# Altium schematic sheet [08] - CPU TF_CARD,USB OTG.SchDoc
size A2; DocumentNumber: 8; SheetNumber: 8; SheetTotal: 20
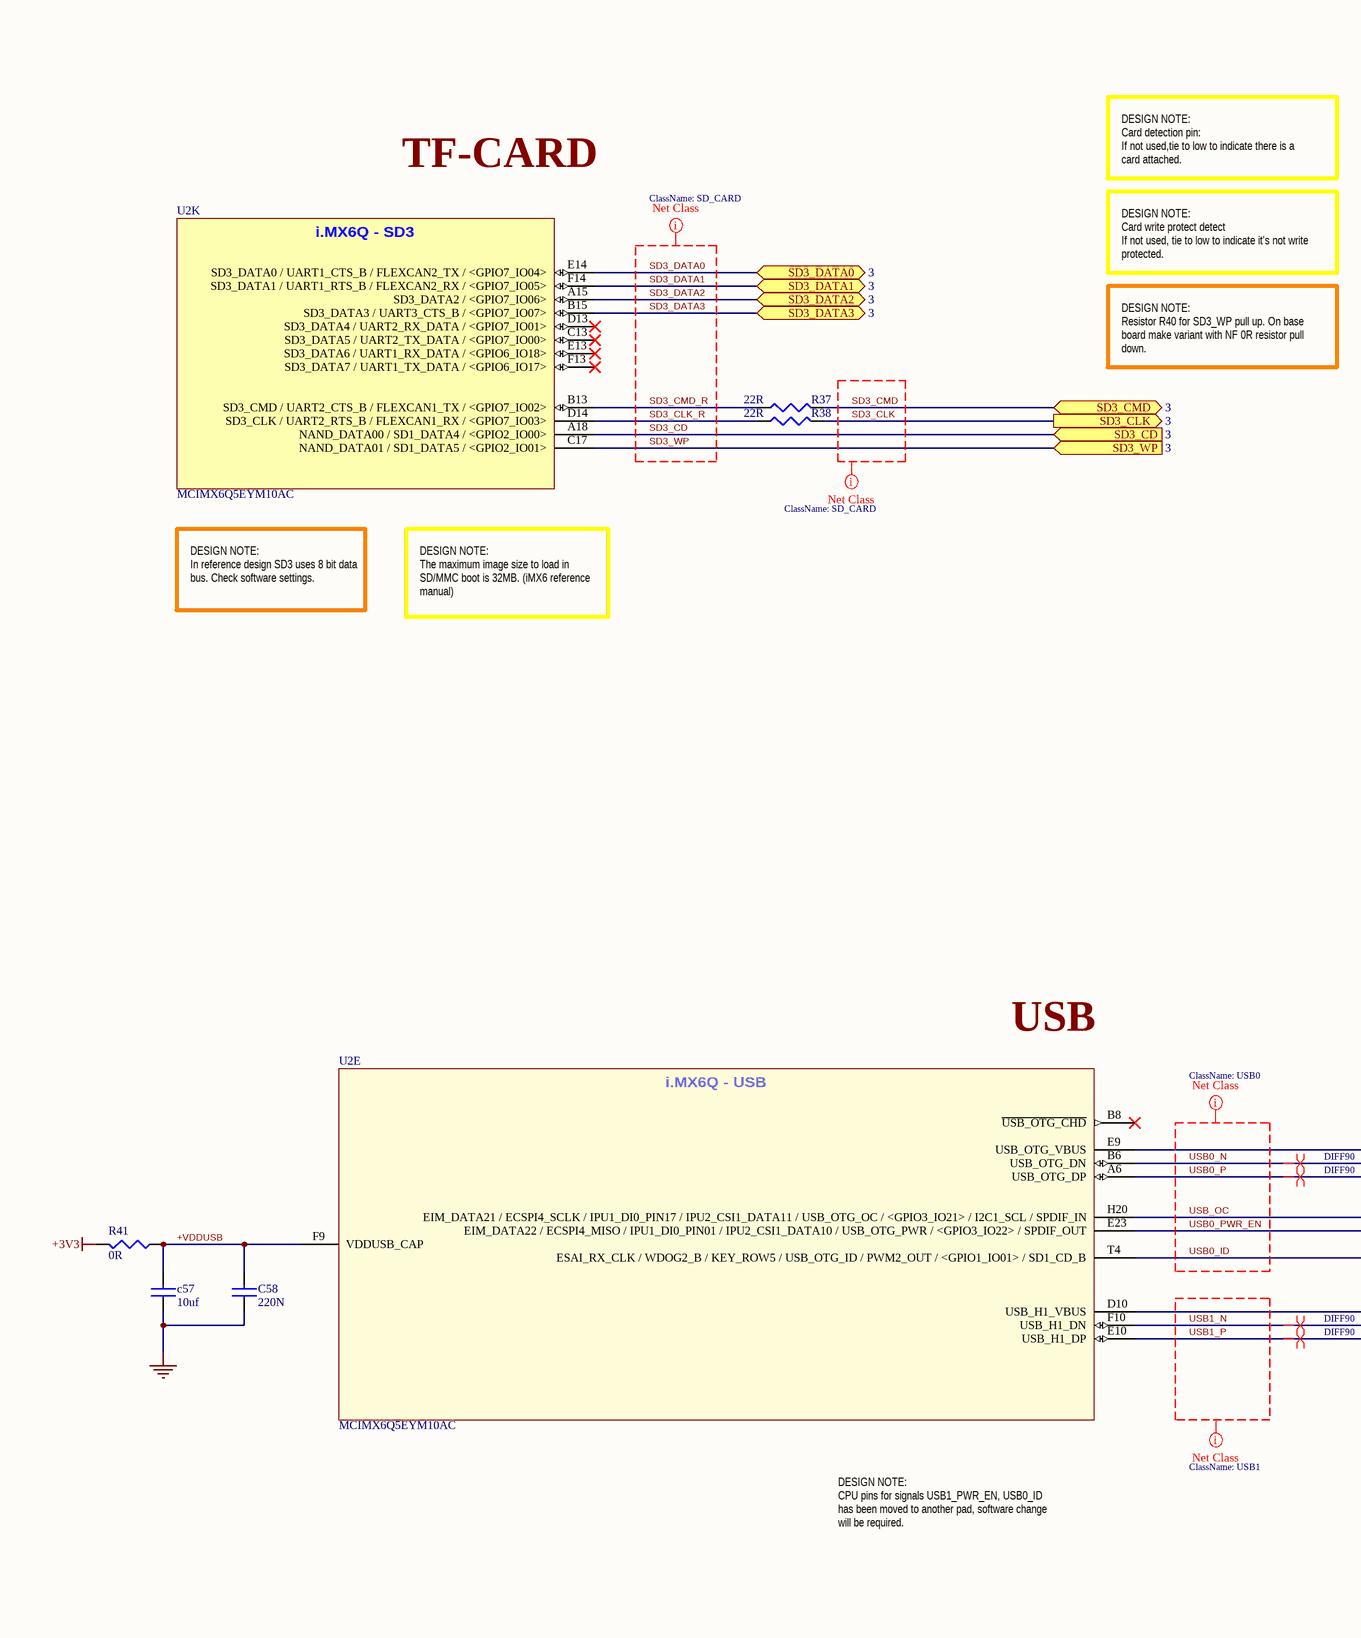
[diagram p0: [08] - CPU TF_CARD,USB OTG.SchDoc, left]
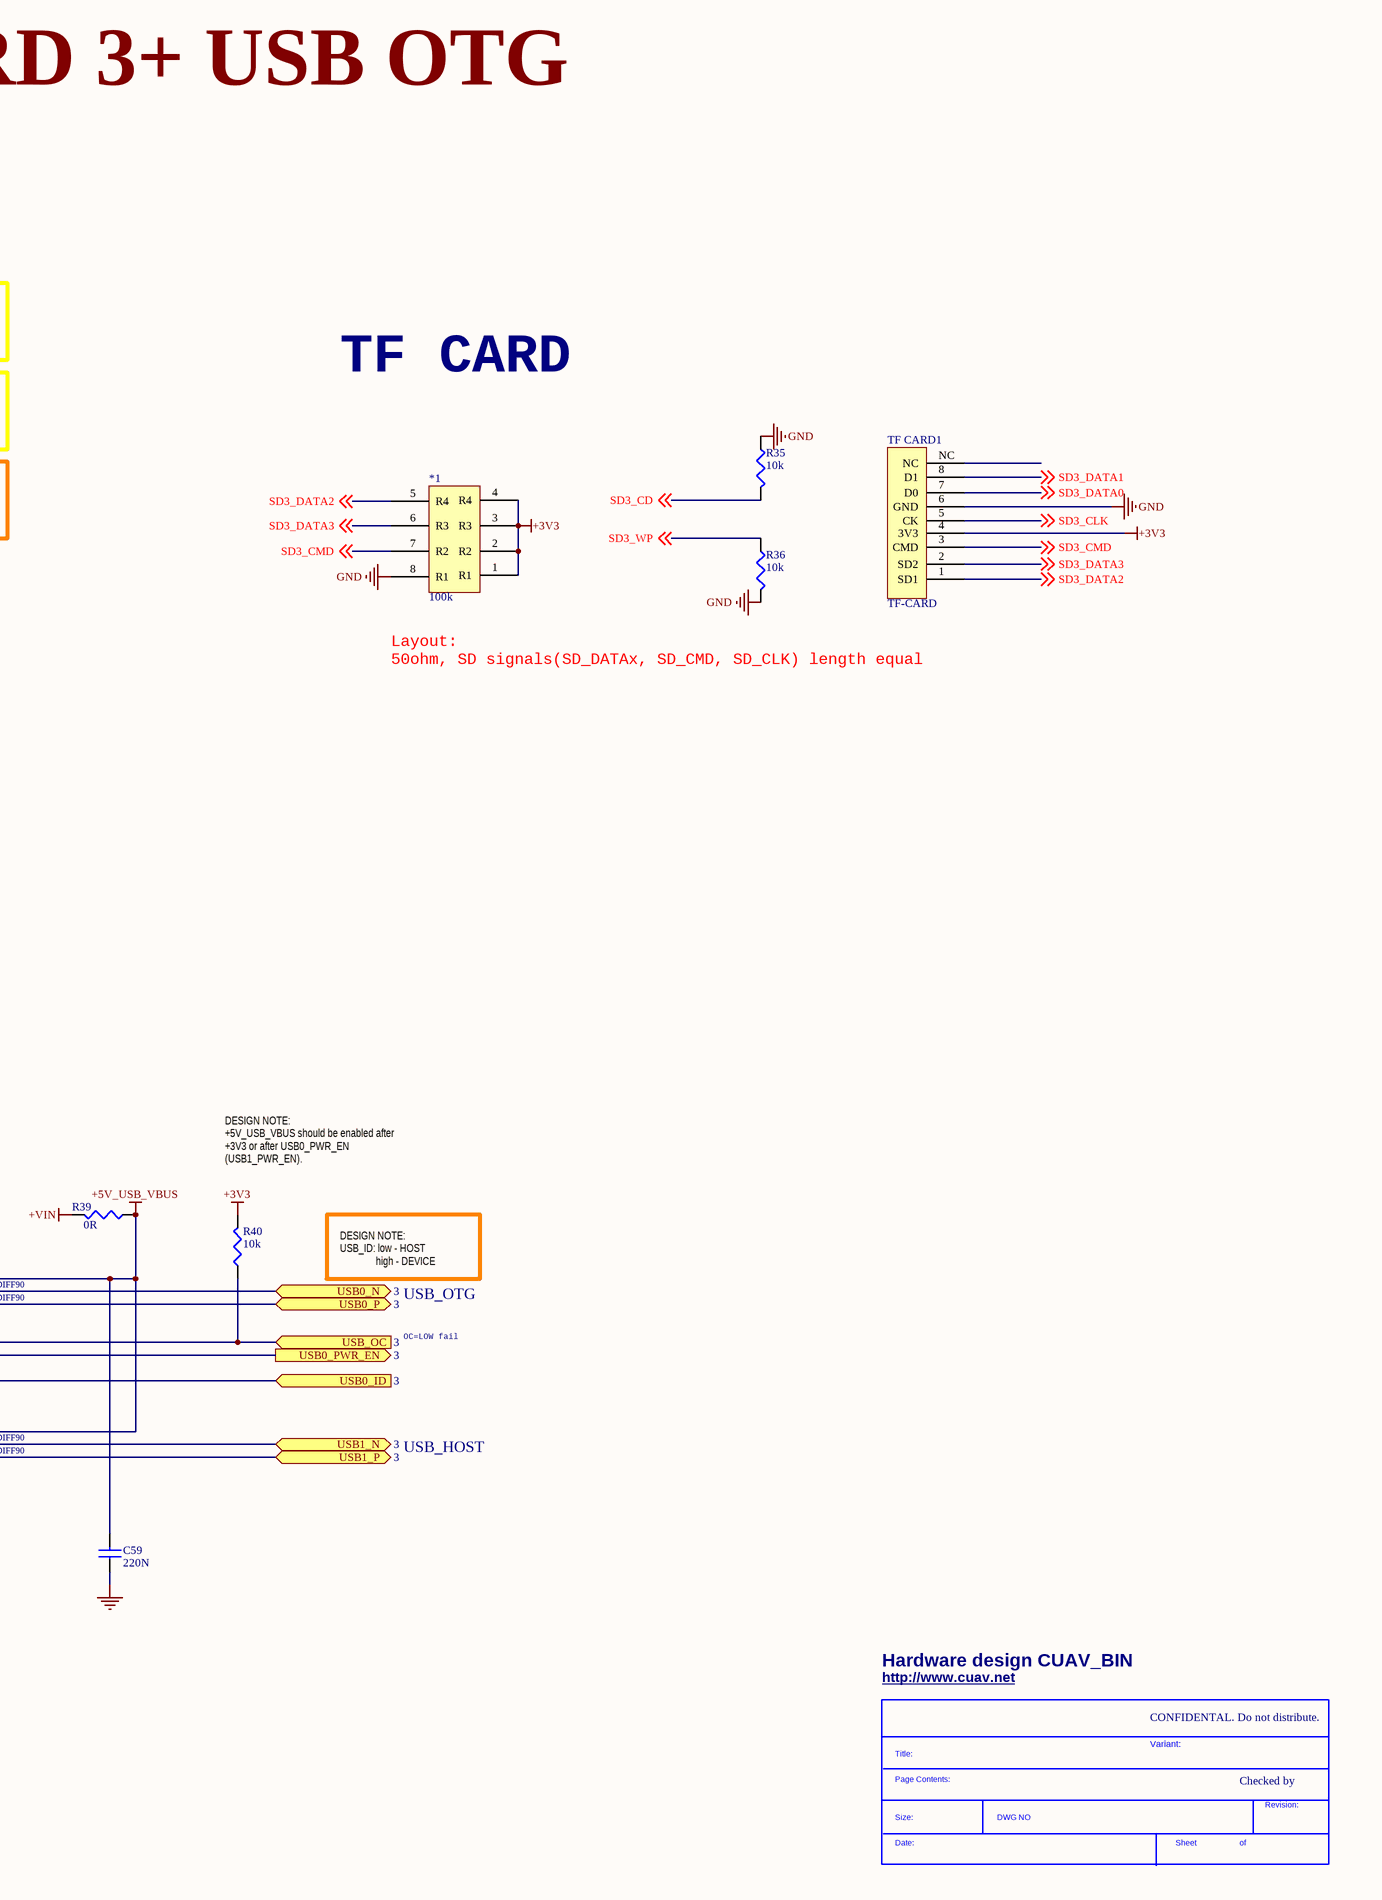
[diagram p1: [08] - CPU TF_CARD,USB OTG.SchDoc, right]

## Parts
*  SDTitleBlock  (value not drawn)  (graphical)
*1  100k  [0402_4R]
c57  10uf  [0402cap]
C58  220N  [0402cap]
C59  220N  [0402cap]
R35  10k  [R0402]
R36  10k  [R0402]
R37  22R  [R0402]
R38  22R  [R0402]
R39  0R  [R0402]
R40  10k  [R0402]
R41  0R  [R0402]
TF_CARD1  TF-CARD  [47352-1001]
U2  MCIMX6Q5EYM10AC  [PBGA624]  (parts E,K of 15)

## Ports
SD3_CD (in, see 3), SD3_CLK (out, see 3), SD3_CMD (bidir, see 3), SD3_DATA0 (bidir, see 3), SD3_DATA1 (bidir, see 3), SD3_DATA2 (bidir, see 3), SD3_DATA3 (bidir, see 3), SD3_WP (in, see 3), USB0_ID (in, see 3), USB0_N (bidir, see 3), USB0_P (bidir, see 3), USB0_PWR_EN (out, see 3), USB1_N (bidir, see 3), USB1_P (bidir, see 3), USB_OC (in, see 3)

## Nets
+3V3: *1.1(R1) *1.2(R2) *1.3(R3) *1.4(R4) R40.2 R41.2 TF_CARD1.4(3V3)
+5V_USB_VBUS: C59.2 R39.1 U2.D10(USB_H1_VBUS) U2.E9(USB_OTG_VBUS)
+VIN: R39.2
GND: *1.8(R1) c57.1 C58.1 C59.1 R35.1 R36.2 TF_CARD1.6(GND)
+VDDUSB: c57.2 C58.2 R41.1 U2.F9(VDDUSB_CAP)
SD3_CD: R35.2 U2.A18(NAND_DATA00_/_SD1_DATA4_/_<GPIO2_IO00>) ; off-sheet SD3_CD, port SD3_CD
SD3_CLK: R38.2 TF_CARD1.5(CK) ; off-sheet SD3_CLK, port SD3_CLK
SD3_CLK_R: R38.1 U2.D14(SD3_CLK_/_UART2_RTS_B_/_FLEXCAN1_RX_/_<GPIO7_IO03>)
SD3_CMD: *1.7(R2) R37.2 TF_CARD1.3(CMD) ; off-sheet SD3_CMD, port SD3_CMD
SD3_CMD_R: R37.1 U2.B13(SD3_CMD_/_UART2_CTS_B_/_FLEXCAN1_TX_/_<GPIO7_IO02>)
SD3_DATA0: TF_CARD1.7(D0) U2.E14(SD3_DATA0_/_UART1_CTS_B_/_FLEXCAN2_TX_/_<GPIO7_IO04>) ; off-sheet SD3_DATA0, port SD3_DATA0
SD3_DATA1: TF_CARD1.8(D1) U2.F14(SD3_DATA1_/_UART1_RTS_B_/_FLEXCAN2_RX_/_<GPIO7_IO05>) ; off-sheet SD3_DATA1, port SD3_DATA1
SD3_DATA2: *1.5(R4) TF_CARD1.1(SD1) U2.A15(SD3_DATA2_/_<GPIO7_IO06>) ; off-sheet SD3_DATA2, port SD3_DATA2
SD3_DATA3: *1.6(R3) TF_CARD1.2(SD2) U2.B15(SD3_DATA3_/_UART3_CTS_B_/_<GPIO7_IO07>) ; off-sheet SD3_DATA3, port SD3_DATA3
SD3_WP: R36.1 U2.C17(NAND_DATA01_/_SD1_DATA5_/_<GPIO2_IO01>) ; off-sheet SD3_WP, port SD3_WP
USB0_ID: U2.T4(ESAI_RX_CLK_/_WDOG2_B_/_KEY_ROW5_/_USB_OTG_ID_/_PWM2_OUT_/_<GPIO1_IO01>_/_SD1_CD_B) ; port USB0_ID
USB0_N: U2.B6(USB_OTG_DN) ; port USB0_N
USB0_P: U2.A6(USB_OTG_DP) ; port USB0_P
USB0_PWR_EN: U2.E23(EIM_DATA22_/_ECSPI4_MISO_/_IPU1_DI0_PIN01_/_IPU2_CSI1_DATA10_/_USB_OTG_PWR_/_<GPIO3_IO22>_/_SPDIF_OUT) ; port USB0_PWR_EN
USB1_N: U2.F10(USB_H1_DN) ; port USB1_N
USB1_P: U2.E10(USB_H1_DP) ; port USB1_P
USB_OC: R40.1 U2.H20(EIM_DATA21_/_ECSPI4_SCLK_/_IPU1_DI0_PIN17_/_IPU2_CSI1_DATA11_/_USB_OTG_OC_/_<GPIO3_IO21>_/_I2C1_SCL_/_SPDIF_IN) ; port USB_OC

Not connected (* = marked no-connect by the designer): TF_CARD1 NC; U2 B8(~{USB_OTG_CHD})* C13(SD3_DATA5_/_UART2_TX_DATA_/_<GPIO7_IO00>)* D13(SD3_DATA4_/_UART2_RX_DATA_/_<GPIO7_IO01>)* E13(SD3_DATA6_/_UART1_RX_DATA_/_<GPIO6_IO18>)* F13(SD3_DATA7_/_UART1_TX_DATA_/_<GPIO6_IO17>)*

## Layout directives
net class SD_CARD: SD3_CD, SD3_CLK, SD3_CLK_R, SD3_CMD, SD3_CMD_R, SD3_DATA0, SD3_DATA1, SD3_DATA2, SD3_DATA3, SD3_WP
differential pair; net class DIFF90: USB0_N, USB0_P, USB1_N, USB1_P
net class USB0: USB0_ID, USB0_N, USB0_P, USB0_PWR_EN, USB_OC
net class USB1: USB1_N, USB1_P

## Notes on the sheet
- CPU - TF CARD 3+ USB OTG
- TF-CARD
- DESIGN NOTE:
  Card detection pin:
  If not used,tie to low to indicate there is a card attached.
- TF CARD
- DESIGN NOTE:
  Card write protect detect
  If not used, tie to low to indicate it's not write protected.
- DESIGN NOTE:
  Resistor R40 for SD3_WP pull up. On base board make variant with NF 0R resistor pull down.
- Layout:
  50ohm, SD signals(SD_DATAx, SD_CMD, SD_CLK) length equal
- DESIGN NOTE:
  In reference design SD3 uses 8 bit data bus. Check software settings.
- DESIGN NOTE:
  The maximum image size to load in SD/MMC boot is 32MB. (iMX6 reference manual)
- USB
- DESIGN NOTE:
  +5V_USB_VBUS should be enabled after +3V3 or after USB0_PWR_EN (USB1_PWR_EN).
- DESIGN NOTE:
  USB_ID: low - HOST
  high - DEVICE
- USB_OTG
- OC=LOW fail
- USB_HOST
- DESIGN NOTE:
  CPU pins for signals USB1_PWR_EN, USB0_ID has been moved to another pad, software change will be required.
- (near *) Hardware design CUAV_BIN
- (near *) http://www.cuav.net
- CONFIDENTAL. Do not distribute.
- Variant:
- Checked by
- (in symbol MCIMX6Q5EYM10AC, part E) i.MX6Q - USB
- (in symbol MCIMX6Q5EYM10AC, part K) i.MX6Q - SD3
- (in symbol SDTitleBlock) Title:; Page Contents:; Revision:; Size:; DWG NO; Date:; Sheet; of

## Library data of the parts
*1 = 0402_4R
c57 C58 C59 = C1005X5R1H104K: CAP CER .10UF 50V X5R 10% 0402; Manufacturer: TDK Corporation; Capacitance: 0.1礔; Value: 100nF; .Checked PCB: used; Tolerance: ?0%; Category: Capacitors; Manufacturer Part Number: C1005X5R1H104K; Operating Temperature: -55癈 ~ 85癈; Package / Case: 0402 (1005 Metric); Price 1k [$]: 0.02340; .Checked SCH: used; Voltage - Rated: 50V; Supplier Part Number: 445-5942-1-ND; Supplier: Digikey; Supplier 1: Digi-Key; Supplier Part Number 1: 445-5942-1-ND; RoHS: RoHS Compliant; Stock 1: 106926; Pricing 1: 1=0.27, 10=0.18, 100=0.072, 250=0.05176, 500=0.0369, 1000=0.027 (USD); Temperature Coefficient: X5R; Mounting Type: Surface Mount, MLCC; Applications: General Purpose; Ratings: -; Size / Dimension: 0.039" L x 0.020" W (1.00mm x 0.50mm); Height - Seated (Max): -; Thickness (Max): 0.022" (0.55mm); Lead Spacing: -; Features: -; Packaging: Cut Tape (CT); Lead Style: -; ComponentLink1URL: http://www.tdk.co.jp/tefe02/e412_c.pdf; ComponentLink1Description: http://www.tdk.co.jp/tefe02/e412_c.pdf
R35 R36 R40 = RC0402FR-0710KL: RES 10.0K OHM 1/16W 1% 0402 SMD; Manufacturer: Yageo; Power (Watts): 0.063W, 1/16W; Tolerance: ?%; .Checked PCB: used; Temperature Coefficient: ?00ppm/癈; Category: Resistors; Supplier Part Number: 311-10.0KLRCT-ND; Manufacturer Part Number: RC0402FR-0710KL; Package / Case: 0402 (1005 Metric); Price 1k [$]: 0.01421; Resistance (Ohms): 10K; Value: 10k; .Checked SCH: used; Supplier: Digikey; Supplier 1: Digi-Key; Supplier Part Number 1: 311-10.0KLRCT-ND; RoHS: RoHS Compliant; Stock 1: 2916495; Pricing 1: 10=0.014, 50=0.0104, 100=0.0079, 250=0.00584, 500=0.00432, 1000=0.00288 (USD); Composition: Thick Film; Features: -; Size / Dimension: 0.039" L x 0.020" W (1.00mm x 0.50mm); Height: 0.016" (0.40mm); Number of Terminations: 2; Packaging: Cut Tape (CT); ComponentLink1URL: http://www.yageo.com/documents/recent/PYu-RC0402_51_RoHS_L_6.pdf; ComponentLink1Description: http://www.yageo.com/documents/recent/PYu-RC0402_51_RoHS_L_6.pdf
R37 R38 = RC0402FR-0722RL: RES 22.0 OHM 1/16W 1% 0402 SMD; Manufacturer: Yageo; Resistance (Ohms): 22; Power (Watts): 0.063W, 1/16W; Tolerance: ?%; .Checked PCB: used; Temperature Coefficient: ?00ppm/癈; Category: Resistors; Supplier Part Number: 311-22.0LRCT-ND; Manufacturer Part Number: RC0402FR-0722RL; Package / Case: 0402 (1005 Metric); Price 1k [$]: 0.01421; Value: 22R; .Checked SCH: used; Supplier: Digikey; Supplier 1: Digi-Key; Supplier Part Number 1: 311-22.0LRCT-ND; RoHS: RoHS Compliant; Stock 1: 943800; Pricing 1: 10=0.014, 50=0.0104, 100=0.0079, 250=0.00584, 500=0.00432, 1000=0.00288 (USD); Composition: Thick Film; Features: -; Size / Dimension: 0.039" L x 0.020" W (1.00mm x 0.50mm); Height: 0.016" (0.40mm); Number of Terminations: 2; Packaging: Cut Tape (CT); ComponentLink1URL: http://www.yageo.com/documents/recent/PYu-RC0402_51_RoHS_L_6.pdf; ComponentLink1Description: http://www.yageo.com/documents/recent/PYu-RC0402_51_RoHS_L_6.pdf
R39 R41 = RC0402FR-0739KL: RES 39.0K OHM 1/16W 1% 0402 SMD; Manufacturer: Yageo; Resistance (Ohms): 39K; Power (Watts): 0.063W, 1/16W; Tolerance: ?%; Value: 39k; .Checked PCB: used; Temperature Coefficient: ?00ppm/癈; Category: Resistors; Manufacturer Part Number: RC0402FR-0739KL; Package / Case: 0402 (1005 Metric); Price 1k [$]: 0.01421; .Checked SCH: used; Supplier Part Number: 311-39.0KLRCT-ND; Supplier: Digikey; Supplier 1: Digi-Key; Supplier Part Number 1: 311-39.0KLRCT-ND; RoHS: RoHS Compliant; Stock 1: 36775; Pricing 1: 10=0.014, 50=0.0104, 100=0.0079, 250=0.00584, 500=0.00432, 1000=0.00288 (USD); Composition: Thick Film; Features: -; Size / Dimension: 0.039" L x 0.020" W (1.00mm x 0.50mm); Height: 0.016" (0.40mm); Number of Terminations: 2; Packaging: Cut Tape (CT); ComponentLink1URL: http://www.yageo.com/documents/recent/PYu-RC0402_51_RoHS_L_6.pdf; ComponentLink1Description: http://www.yageo.com/documents/recent/PYu-RC0402_51_RoHS_L_6.pdf
TF_CARD1 = 47352-1001
U2 = MCIMX6Q5EYM10AC: IC MCU 32BIT ARM QUAD 624FCBGA; Manufacturer: Freescale Semiconductor; Core Processor: ARM?Cortex?A9; Core Size: 32-Bit Quad-Core; Speed: 1.0GHz; Connectivity: CAN, EBI/EMI, ESAI, Ethernet, GPMI, I2C, MMC/SD, PCI, SATA, SPI, UART, USB, USB OTG; Peripherals: DMA, HDMI, I2S/SSI/AC97, MIPI CSI, MIMI DSI, MIPI HIS, PWM, WDT; Number of I /O: 224; Program Memory Type: External Program Memory; RAM Size: 256K x 8; Voltage - Supply (Vcc/Vdd): 0.925 V ~ 1.5 V; Oscillator Type: Internal; .Creator: MM; .Checked PCB: MM, checked by RF; Supplier 1: Digi-Key; Manufacturer Part Number: MCIMX6Q5EYM10AC; RoHS: RoHS Compliant; Category: Integrated Circuits (ICs); Stock 1: 0; Pricing 1: 1=54.98, 10=51.922, 25=48.868, 100=30.5424 (USD); Program Memory Size: -; EEPROM Size: -; Data Converters: -; Operating Temperature: -20癈 ~ 105癈; Package / Case: 624-FBGA, FCBGA; Packaging: Tray; ComponentLink1URL: http://cache.freescale.com/files/32bit/doc/data_sheet/IMX6DQCEC.pdf; ComponentLink1Description: http://cache.freescale.com/files/32bit/doc/data_sheet/IMX6DQCEC.pdf; Supplier Part Number 1: MCIMX6Q5EYM10AC-ND; .Checked SCH: MM